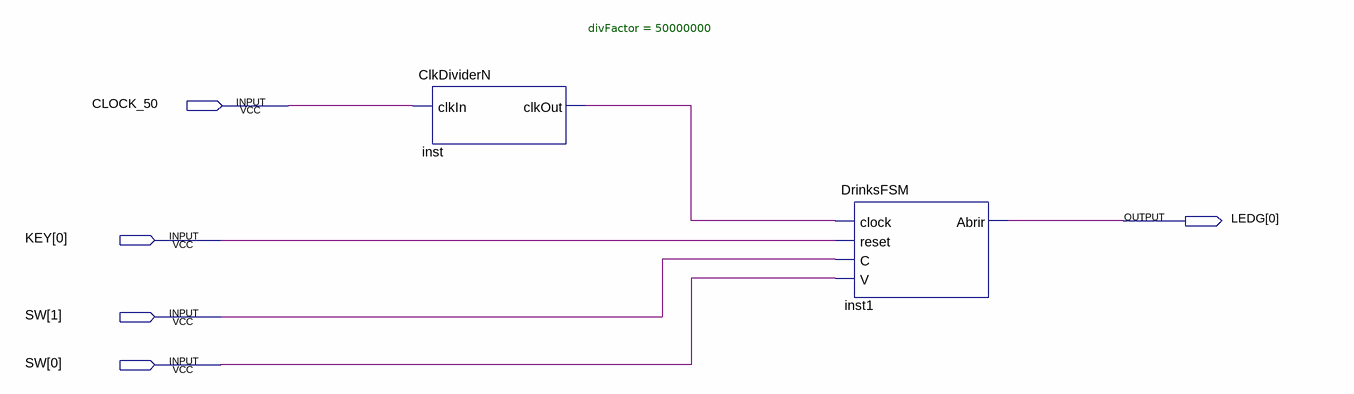
[diagram p0: schematic sheet]
// Quartus schematic DrinkMachine.bdf as structural Verilog: 2 symbols, 5 pins
module DrinkMachine (
  input  CLOCK_50,
  input  [0:0] KEY,
  input  [1:0] SW,
  output [0:0] LEDG
);

  wire inst_clkout;

  ClkDividerN #(.divFactor(50000000)) inst (.clkIn(CLOCK_50), .clkOut(inst_clkout));
  DrinksFSM inst1 (.clock(inst_clkout), .reset(KEY[0]), .C(SW[1]), .V(SW[0]), .Abrir(LEDG[0]));
endmodule
